# Altium schematic sheet Power_Sources_2.SchDoc
size A4
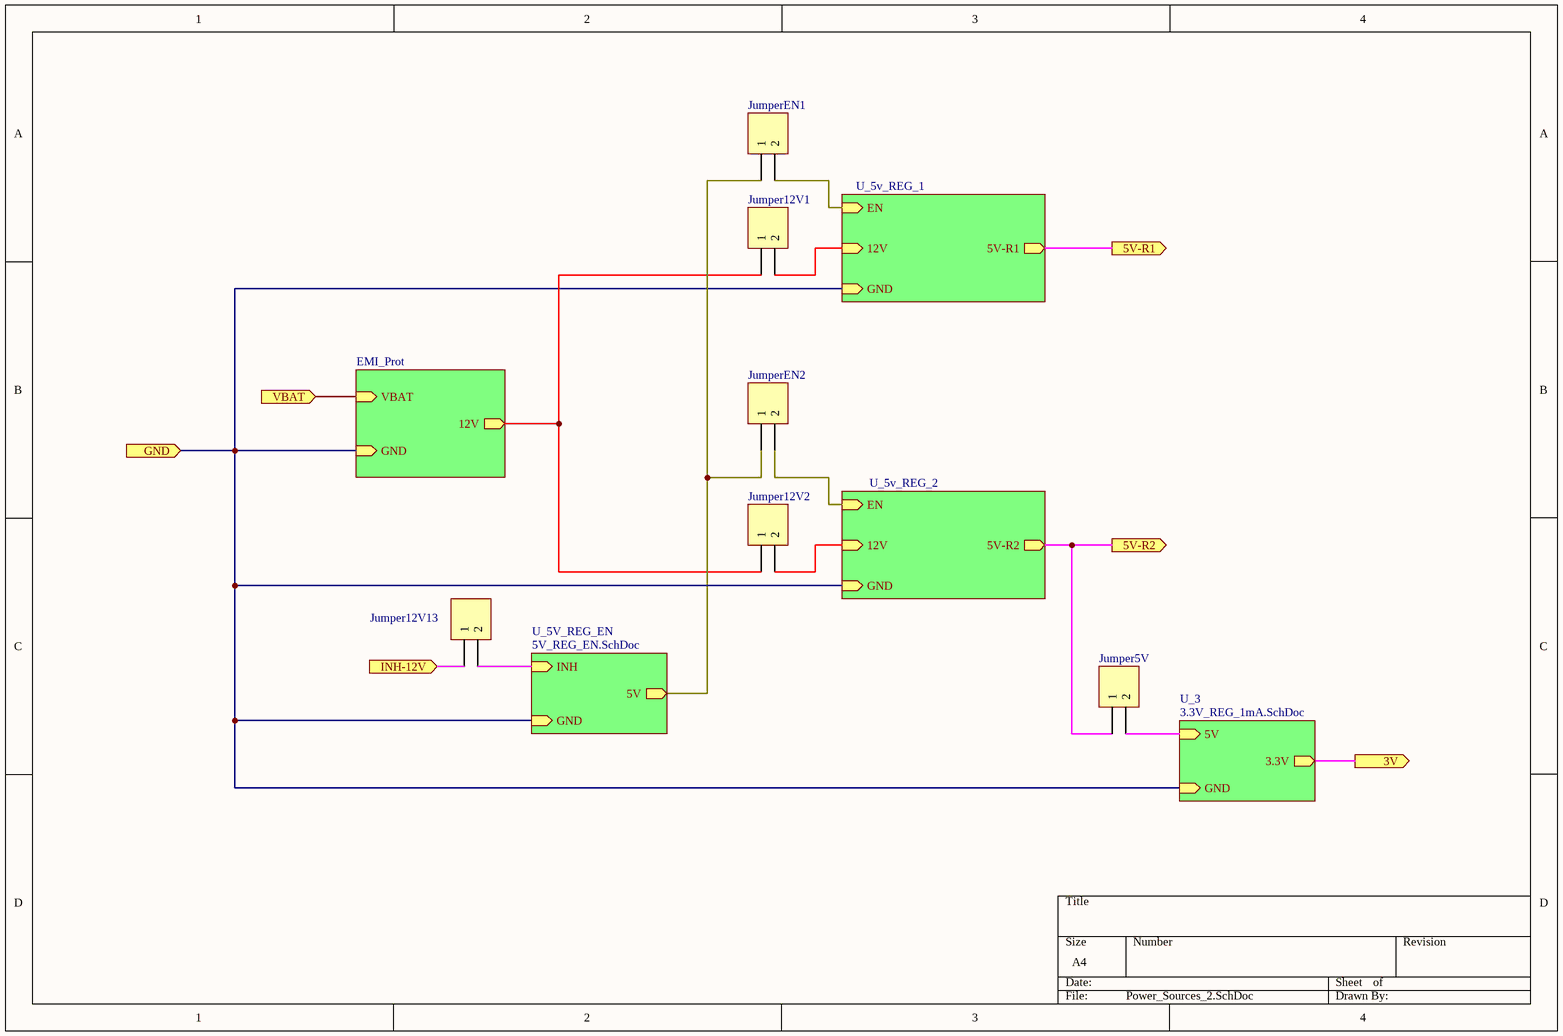
[diagram p0: Power_Sources_2.SchDoc]

## Parts
Jumper5V  Header 2H  [HDR1X2H]  (value not drawn)
Jumper12V1  Header 2H  [HDR1X2H]  (value not drawn)
Jumper12V2  Header 2H  [HDR1X2H]  (value not drawn)
Jumper12V13  Header 2H  [HDR1X2H]  (value not drawn)
JumperEN1  Header 2H  [HDR1X2H]  (value not drawn)
JumperEN2  Header 2H  [HDR1X2H]  (value not drawn)

## Sub-sheets
EMI_Prot = ?: VBAT (in), GND (in), 12V (out)
U_3 = 3.3V_REG_1mA.SchDoc: 5V (in), GND (in), 3.3V (out)
U_5v_REG_1 = ?: 12V (in), GND (in), EN (in), 5V-R1 (out)
U_5v_REG_2 = ?: 12V (in), GND (in), EN (in), 5V-R2 (out)
U_5V_REG_EN = 5V_REG_EN.SchDoc: INH (in), GND (in), 5V (out)

## Ports
3V (out), 5V-R1 (out), 5V-R2 (out), GND (in), INH-12V (in), VBAT (in)

## Nets
3V: port 3V, sheet U_3/3.3V
5V-R1: port 5V-R1, sheet U_5v_REG_1/5V-R1
5V-R2: Jumper5V.1 ; port 5V-R2, sheet U_5v_REG_2/5V-R2
GND: port GND, sheet U_5v_REG_1/GND, sheet U_5v_REG_2/GND, sheet EMI_Prot/GND, sheet U_3/GND, sheet U_5V_REG_EN/GND
INH-12V: Jumper12V13.1 ; port INH-12V
VBAT: port VBAT, sheet EMI_Prot/VBAT
NetJumper5V_2: Jumper5V.2 ; sheet U_3/5V
NetJumper12V1_1: Jumper12V1.1 Jumper12V2.1 ; sheet EMI_Prot/12V
NetJumper12V1_2: Jumper12V1.2 ; sheet U_5v_REG_1/12V
NetJumper12V2_2: Jumper12V2.2 ; sheet U_5v_REG_2/12V
NetJumper12V13_2: Jumper12V13.2 ; sheet U_5V_REG_EN/INH
NetJumperEN1_1: JumperEN1.1 JumperEN2.1 ; sheet U_5V_REG_EN/5V
NetJumperEN1_2: JumperEN1.2 ; sheet U_5v_REG_1/EN
NetJumperEN2_2: JumperEN2.2 ; sheet U_5v_REG_2/EN

## Library data of the parts
Jumper5V Jumper12V1 Jumper12V2 Jumper12V13 JumperEN1 JumperEN2 = Header 2H: Header, 2-Pin, Right Angle; LatestRevisionDate: 17-Jul-2002; LatestRevisionNote: Re-released for DXP Platform.; Publisher: Altium Limited